# EAGLE design STWD100 Charger Controller rev1 (EAGLE 9.6.2)
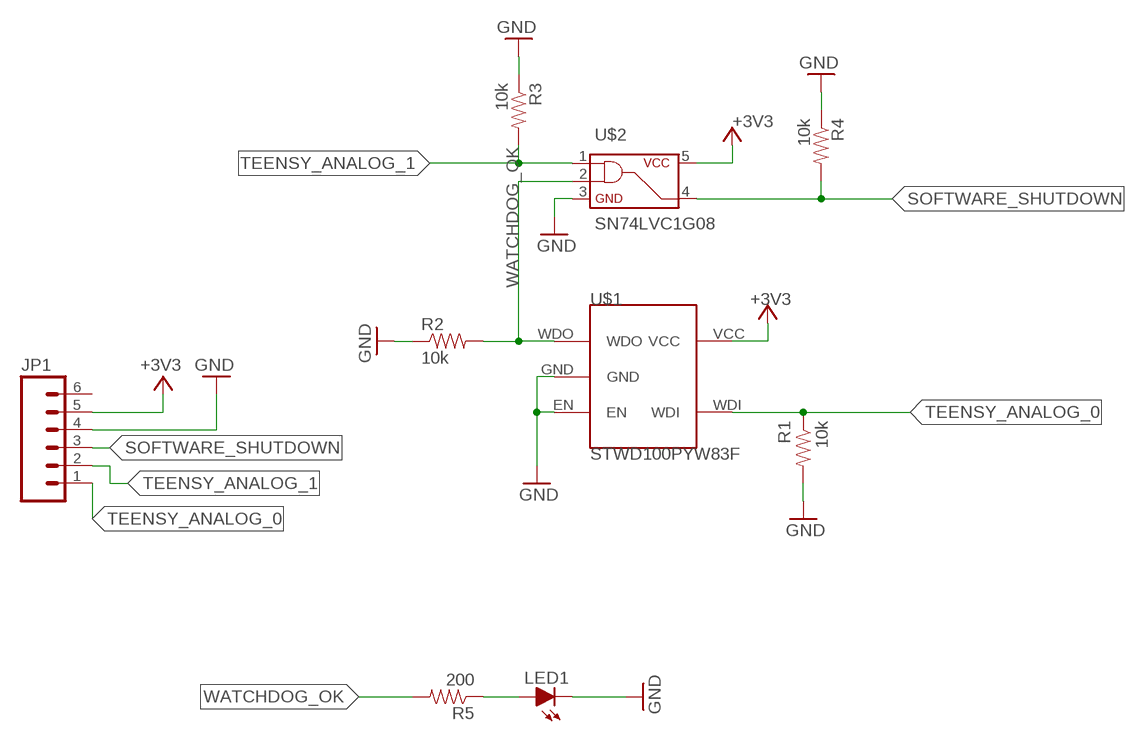
[diagram p0: schematic, sheet 1]

## Parts
JP1  M06  [1X06]
LED1  LED-0603  [LED-603]
R1  10k  RESISTOR0603-RES  [0603-RES]
R2  10k  RESISTOR0603-RES  [0603-RES]
R3  10k  RESISTOR0603-RES  [0603-RES]
R4  10k  RESISTOR0603-RES  [0603-RES]
R5  200  RESISTOR0603-RES  [0603-RES]
U$1  STWD100PYW83F  [SOT323-5]
U$2  SN74LVC1G08  [SOT-23-5]

## Nets
+3V3: JP1.5 U$1.VCC U$2.5
GND: JP1.4 LED1.C R1.2 R2.1 R3.1 R4.1 U$1.EN U$1.GND U$2.3
N$1: LED1.A R5.1
SOFTWARE_SHUTDOWN: JP1.3 R4.2 U$2.4
TEENSY_ANALOG_0: JP1.1 R1.1 U$1.WDI
TEENSY_ANALOG_1: JP1.2 R3.2 U$2.1
WATCHDOG_OK: R2.2 R5.2 U$1.WDO U$2.2
Unconnected: JP1.6

## Library data of the parts
JP1 = HyTechDevices:M06: Standard 6-pin 0.1" header. NOTES ON THE VARIANTS LOCK and LOCK_LONGPADS... This footprint was designed to help hold the alignment of a through-hole component (i.e. 6-pin header) while soldering it into place. You may notice that each hole has been shifted either up or down by 0.005 of an inch from it's more standard position (which is a perfectly straight line). This slight alteration caused the pins (the squares in the middle) to touch the edges of the holes. Because they are alternating, it causes a "brace" to hold the component in place. 0.005 has proven to be the perfect amount of "off-center" position when using our standard breakaway headers. Although looks a little odd when you look at the bare footprint, once you have a header in there, the alteration is very hard to notice. Also,if you push a header all the way into place, it is covered up entirely on the bottom side. This idea of altering the position of holes to aid alignment will be further integrated into the Sparkfun Library for other footprints. It can help hold any component with 3 or more connection pins. Note: The Sparkfun version includes many other packages including surface mount that may be of future interest. Source: Sparkfun <https://github.com/sparkfun/SparkFun-Eagle-Libraries>
LED1 = HyTechDevices:LED: Light Emitting Diode (LED) Source: Dangerous Prototypes Eagle Library <https://github.com/DangerousPrototypes/Eagle_Part_Library>
R1-R5 = HyTechDevices:RESISTOR: Resistor Basic schematic elements and footprints for 0603, 1206, and PTH resistors.
U$1 = HyTechDevices:STWD100PYW83F: STWD100 Watchdog Timer (push-pull configuration) Datasheet <https://www.st.com/resource/en/datasheet/stwd100.pdf>
U$2 = HyTechDevices:SN74LVC1G08: TI SN74LVC1G08 SINGLE 2-INPUT POSITIVE-AND GATE Datasheet <http://www.ti.com/lit/ds/sces556f/sces556f.pdf>

## Board
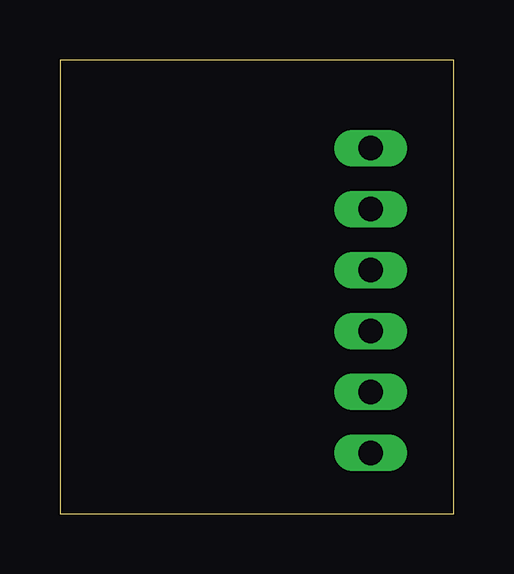
[diagram p1: board, top side]
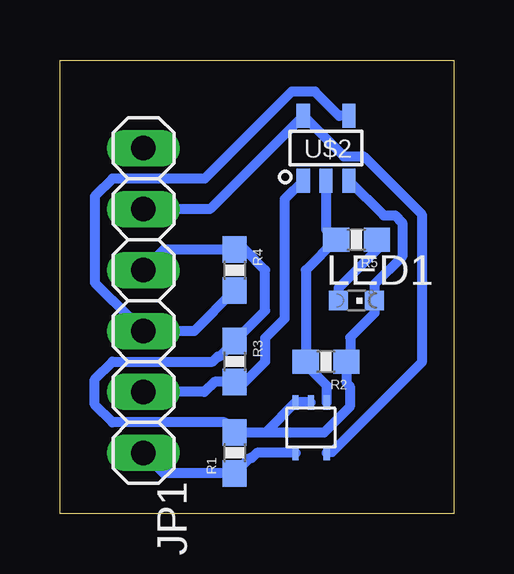
[diagram p2: board, bottom side, seen from below]

Size 16.43 x 18.91 mm. Coordinates in mm from the lower left corner, seen from the top.
Outline: 0,0 16.43,0 16.43,18.91 0,18.91 0,0
Copper layers 16: Bottom 0.035mm
Design rules "On Campus (1 Layer)": minimum track width 16mil, minimum drill 0.8mm, track to track 16mil, track to pad 12mil, pad to pad 16mil, via to via 16mil, smd to smd 10mil, copper to edge 40mil, drill to drill 10mil, minimum pad ring 10mil, minimum via ring 8mil, stop-mask expansion 4mil, vias tented up to drill 0mil, thermal gap 10mil

### Footprints (pad centres in the part's own frame; a part is rotated, then mirrored left to right if it is on the bottom)
1X06 = drill 1.016 long: 1 -6.35,0; 2 -3.81,0; 3 -1.27,0; 4 1.27,0; 5 3.81,0; 6 6.35,0
LED-603 = smd 0.8 x 0.8: A 0,-0.75; C 0,0.75
0603-RES = smd 1.1 x 1: 1 -0.85,0; 2 0.85,0
SOT323-5 = smd 0.61 x 0.254: EN -2.108,0; GND -2.108,0.635; VCC 0,1.295; WDI 0,0; WDO -2.108,1.295
SOT-23-5 = smd 1 x 0.55: 1 -1.35,0.95; 2 -1.35,0; 3 -1.35,-0.95; 4 1.35,-0.95; 5 1.35,0.95

### Placement (x,y rotation side)
JP1  12.95,8.89 90 bottom
LED1  4.06,8.89 270 bottom
R1  9.14,2.54 90 bottom
R2  5.33,6.35 180 bottom
R3  9.14,6.35 270 bottom
R4  9.14,10.16 270 bottom
R5  4.06,11.43 180 bottom
U$1  6.6,2.54 270 bottom
U$2  5.33,15.24 90 bottom

### Tracks (layer width: path | path; a pad name or v marks a point on that pad's centre or on a via)
+3V3
  Bottom 0.406: JP1.5 10.17,12.7 U$2.5 4.59,14.9 3.76,14.9 1.34,12.48 1.34,6.31 5.08,2.58 5.27,2.58 U$1.VCC
GND
  Bottom 0.406: U$1.GND U$1.EN 7.86,3.39 | 7.86,3.39 R1.2 9.56,3.81 14.24,3.81 14.99,4.55 14.99,5.61 14.24,6.35 10.06,6.35 9.85,6.56 9.79,6.56 R3.1 7.87,8.47 7.87,10.16 8.72,11.01 R4.1 12.1,11.01 JP1.4 | U$2.3 2.93,12.44 2.45,12.44 2.16,12.14 2.16,10.72 3.31,9.56 LED1.C 3.31,8.37 4.32,7.36 4.32,6.51 R2.1 4.48,5.46 4.34,5.32 4.34,4.46 5.42,3.39 7.86,3.39
N$1
  Bottom 0.406: R5.1 3.21,11.01 4.81,9.41 LED1.A
SOFTWARE_SHUTDOWN
  Bottom 0.406: R4.2 10.83,7.62 JP1.3 14.22,8.89 14.24,8.89 14.99,9.63 14.99,13.23 14.24,13.97 10.4,13.97 6.77,17.6 5.8,17.6 4.79,16.59 U$2.4
TEENSY_ANALOG_0
  Bottom 0.406: U$1.WDI 8.23,2.54 8.43,2.33 8.5,2.33 R1.1 12.1,1.69 JP1.1
TEENSY_ANALOG_1
  Bottom 0.406: JP1.2 10.41,5.08 9.99,5.5 R3.2 8.72,5.5 7.87,6.35 7.87,7.32 7.06,8.13 7.06,13.11 U$2.1
WATCHDOG_OK
  Bottom 0.406: U$2.2 5.33,11.85 R5.2 6.18,10.16 R2.2 6.18,6.22 5.31,5.35 U$1.WDO